# EAGLE design Lighthouse (EAGLE 9.6.2)
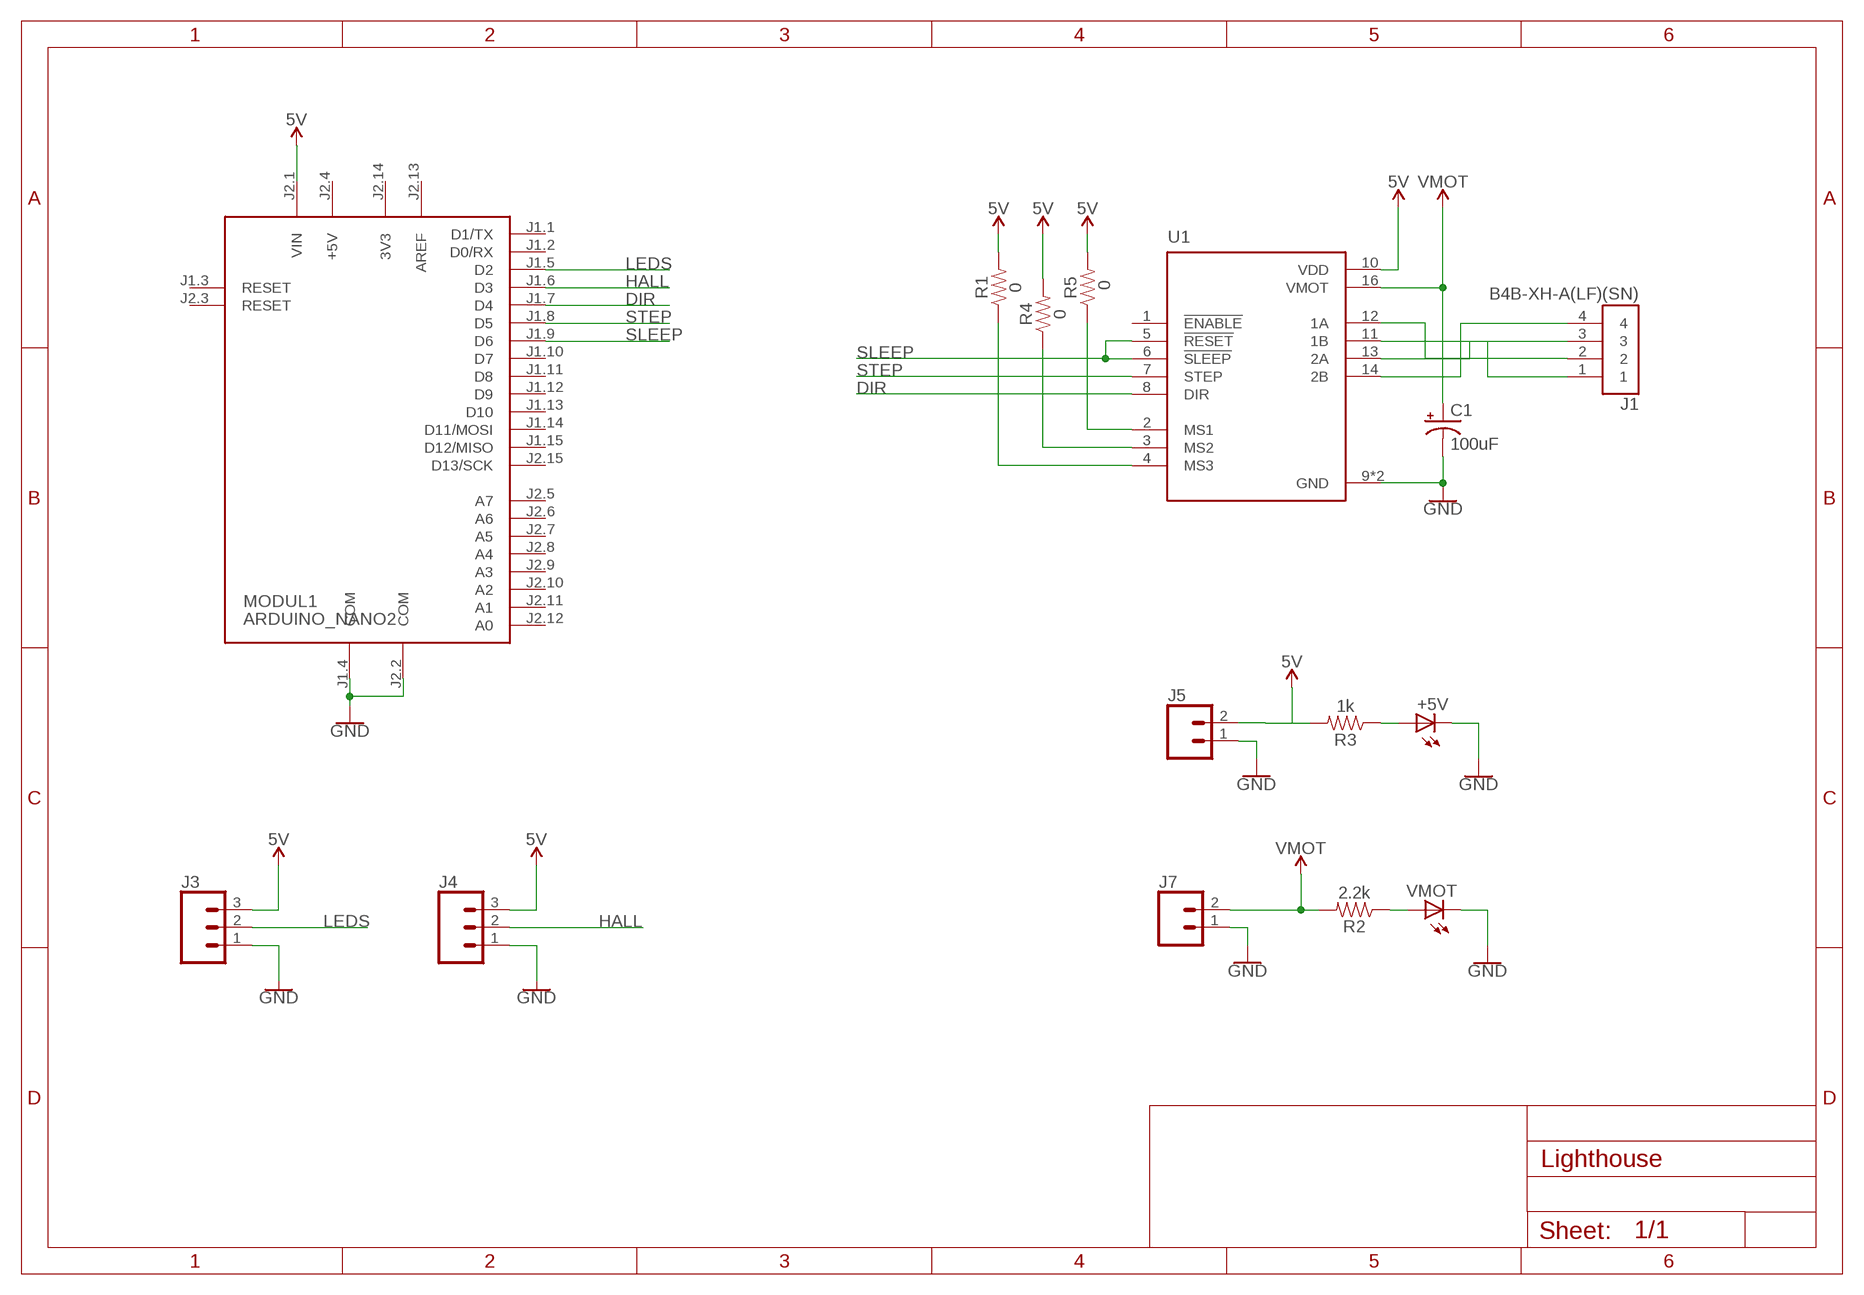
[diagram p0: schematic, sheet 1]

## Parts
+5V  LEDP-LCC-2  [P-LCC-2]
C1  100uF  100UF-POLAR-25V-20%(ELEC)  [PANASONIC_D]
J1  B4B-XH-A(LF)(SN)  [JST_B4B-XH-A(LF)(SN)]
J3  CONN_03SCREW  [SCREWTERMINAL-3.5MM-3]
J4  CONN_03SCREW  [SCREWTERMINAL-3.5MM-3]
J5  CONN_025MM  [SCREWTERMINAL-5MM-2]
J7  CONN_025MM  [SCREWTERMINAL-5MM-2]
MODUL1  ARDUINO_NANO2  [ARDUINO_NANO2]
R1  0  RESISTOR1206  [1206]
R2  2.2k  RESISTOR1206  [1206]
R3  1k  RESISTOR1206  [1206]
R4  0  RESISTOR1206  [1206]
R5  0  RESISTOR1206  [1206]
U1  A4988_STEPPER_MOTOR_DRIVER_CARRIER  [MODULE_A4988_STEPPER_MOTOR_DRIVER_CARRIER]
VMOT  LEDP-LCC-2  [P-LCC-2]

## Nets
5V: J3.3 J4.3 J5.2 MODUL1.J2.1(VIN) R1.2 R3.2 R4.2 R5.2 U1.10(VDD)
12V: C1.+ J7.2 R2.2 U1.16(VMOT) ; supply symbol labelled VMOT
DIR: MODUL1.J1.7(D4) U1.8(DIR)
GND: +5V.C C1.- J3.1 J4.1 J5.1 J7.1 MODUL1.J1.4(COM) MODUL1.J2.2(COM) U1.9(GND) U1.15(GND) VMOT.C
HALL: J4.2 MODUL1.J1.6(D3)
LEDS: J3.2 MODUL1.J1.5(D2)
N$1: +5V.A R3.1
N$3: R2.1 VMOT.A
N$7: J1.4 U1.14(2B)
N$8: J1.3 U1.13(2A)
N$9: J1.1 U1.11(1B)
N$10: J1.2 U1.12(1A)
N$11: R1.1 U1.4(MS3)
N$12: R4.1 U1.3(MS2)
N$13: R5.1 U1.2(MS1)
SLEEP: MODUL1.J1.9(D6) U1.5(!RESET) U1.6(!SLEEP)
STEP: MODUL1.J1.8(D5) U1.7(STEP)
Unconnected: MODUL1.J1.1(D1/TX) MODUL1.J1.2(D0/RX) MODUL1.J1.3(RESET) MODUL1.J1.10(D7) MODUL1.J1.11(D8) MODUL1.J1.12(D9) MODUL1.J1.13(D10) MODUL1.J1.14(D11/MOSI) MODUL1.J1.15(D12/MISO) MODUL1.J2.3(RESET) MODUL1.J2.5(A7) MODUL1.J2.6(A6) MODUL1.J2.7(A5) MODUL1.J2.8(A4) MODUL1.J2.9(A3) MODUL1.J2.10(A2) MODUL1.J2.11(A1) MODUL1.J2.12(A0) MODUL1.J2.15(D13/SCK) U1.1(!ENABLE)

## Power pins joined to a net without a drawn wire
3V3: MODUL1.J2.14(3V3)
+5V: MODUL1.J2.4(+5V)
AREF: MODUL1.J2.13(AREF)

## Library data of the parts
+5V VMOT = adafruit:LED: LED OSRAM: - CHIPLED LG R971, LG N971, LY N971, LG Q971, LY Q971, LO R971, LY R971 LH N974, LH R974 LS Q976, LO Q976, LY Q976 LO Q996 - Hyper CHIPLED LW Q18S LB Q993, LB Q99A, LB R99A - SideLED LS A670, LO A670, LY A670, LG A670, LP A670 LB A673, LV A673, LT A673, LW A673 LH A674 LY A675 LS A676, LA A676, LO A676, LY A676, LW A676 LS A679, LY A679, LG A679 - Hyper Micro SIDELED® LS Y876, LA Y876, LO Y876, LY Y876 LT Y87S - SmartLED LW L88C, LW L88S LB L89C, LB L89S, LG L890 LS L89K, LO L89K, LY L89K LS L896, LA L896, LO L896, LY L896 - TOPLED LS T670, LO T670, LY T670, LG T670, LP T670 LSG T670, LSP T670, LSY T670, LOP T670, LYG T670 LG T671, LOG T671, LSG T671 LB T673, LV T673, LT T673, LW T673 LH T674 LS T676, LA T676, LO T676, LY T676, LB T676, LH T676, LSB T676, LW T676 LB T67C, LV T67C, LT T67C, LS T67K, LO T67K, LY T67K, LW E67C LS E67B, LA E67B, LO E67B, LY E67B, LB E67C, LV E67C, LT E67C LW T67C LS T679, LY T679, LG T679 LS T770, LO T770, LY T770, LG T770, LP T770 LB T773, LV T773, LT T773, LW T773 LH T774 LS E675, LA E675, LY E675, LS T675 LS T776, LA T776, LO T776, LY T776, LB T776 LHGB T686 LT T68C, LB T68C - Hyper Mini TOPLED® LB M676 - Mini TOPLED Santana® LG M470 LS M47K, LO M47K, LY M47K Source: http://www.osram.convergy.de/
C1 = SparkFun-Capacitors:100UF-POLAR: 100µF polarized capacitors A capacitor is a passive two-terminal electrical component used to store electrical energy temporarily in an electric field.; PROD_ID: CAP-12547
J1 = B4B-XH-A_LF__SN_:B4B-XH-A(LF)(SN): XH Series 4 Position 2.5 mm Pitch Through Hole Crimp Top Entry Shrouded Header Check prices <https://pricing.snapeda.com/parts/B4B-XH-A%28LF%29%28SN%29/JST%20Sales/view-part?ref=eda>; AVAILABILITY: Warning; DESCRIPTION: Connector Header Through Hole 4 position 0.098 (2.50mm); MF: JST Sales; MP: B4B-XH-A(LF)(SN); PACKAGE: None; PRICE: None; PURCHASE-URL: https://pricing.snapeda.com/search/part/B4B-XH-A(LF)(SN)/?ref=eda
J3 J4 = SparkFun-Connectors:CONN_03: Multi connection point. Often used as Generic Header-pin footprint for 0.1 inch spaced/style header connections On any of the 0.1 inch spaced packages, you can populate with these: Break Away Headers - Straight <https://www.sparkfun.com/products/116> (PRT-00116) Break Away Male Headers - Right Angle <https://www.sparkfun.com/products/553> (PRT-00553) Female Headers <https://www.sparkfun.com/products/115> (PRT-00115) Break Away Headers - Machine Pin <https://www.sparkfun.com/products/117> (PRT-00117) Break Away Female Headers - Swiss Machine Pin <https://www.sparkfun.com/products/743> (PRT-00743) Stackable Header - 3 Pin (Female, 0.1") <https://www.sparkfun.com/products/13875> (PRT-13875) For SCREWTERMINALS and SPRING TERMINALS visit here: Screw Terimnals on SparkFun.com <https://www.sparkfun.com/search/results?term=Screw+Terminals> (5mm/3.5mm/2.54mm spacing) This device is also useful as a general connection point to wire up your design to another part of your project. Our various solder wires solder well into these plated through hole pads. Hook-Up Wire - Assortment (Stranded, 22 AWG) <https://www.sparkfun.com/products/11375> (PRT-11375) Hook-Up Wire - Assortment (Solid Core, 22 AWG) <https://www.sparkfun.com/products/11367> (PRT-11367) View the entire wire category on our website here <https://www.sparkfun.com/categories/141> Special notes: Molex polarized connector foot print use with SKU : PRT-08232 with associated crimp pins and housings.; PROD_ID: CONN-08288; SF_ID: PRT-08235
J5 J7 = SparkFun-Connectors:CONN_02: Multi connection point. Often used as Generic Header-pin footprint for 0.1 inch spaced/style header connections On any of the 0.1 inch spaced packages, you can populate with these: Break Away Headers - Straight <https://www.sparkfun.com/products/116> (PRT-00116) Break Away Male Headers - Right Angle <https://www.sparkfun.com/products/553> (PRT-00553) Female Headers <https://www.sparkfun.com/products/115> (PRT-00115) Break Away Headers - Machine Pin <https://www.sparkfun.com/products/117> (PRT-00117) Break Away Female Headers - Swiss Machine Pin <https://www.sparkfun.com/products/743> (PRT-00743) For SCREWTERMINALS and SPRING TERMINALS visit here: Screw Terimnals on SparkFun.com <https://www.sparkfun.com/search/results?term=Screw+Terminals> (5mm/3.5mm/2.54mm spacing) This device is also useful as a general connection point to wire up your design to another part of your project. Our various solder wires solder well into these plated through hole pads. Hook-Up Wire - Assortment (Stranded, 22 AWG) <https://www.sparkfun.com/products/11375> (PRT-11375) Hook-Up Wire - Assortment (Solid Core, 22 AWG) <https://www.sparkfun.com/products/11367> (PRT-11367) View the entire wire category on our website here <https://www.sparkfun.com/categories/141> Special notes: Molex polarized connector foot print use with: PRT-08233 with associated crimp pins and housings. 2.54_SCREWTERM for use with PRT-10571. 3.5mm Screw Terminal footprints for PRT-08084 5mm Screw Terminal footprints for use with PRT-08432; SF_SKU: PRT-08432
MODUL1 = arduino:ARDUINO_NANO2: Arduino Nano2 Auto generated by modulcreator.ulp \;; ANZAHL: 2; MODUL: TRUE; STECKX0: -76200; STECKX1: 76200; STECKY0: 177800; STECKY1: 177800
R1-R5 = SparkFun-Resistors:RESISTOR: Generic Resistor Package
U1 = A4988_STEPPER_MOTOR_DRIVER_CARRIER:A4988_STEPPER_MOTOR_DRIVER_CARRIER: Stepper motor controler; IC: A4988; 1A; Uin mot: 8÷35V; AVAILABILITY: Unavailable; DESCRIPTION: Stepper Motor Driver; MF: Pololu; MP: A4988 STEPPER MOTOR DRIVER CARRIER; PACKAGE: None; PRICE: None

## Board
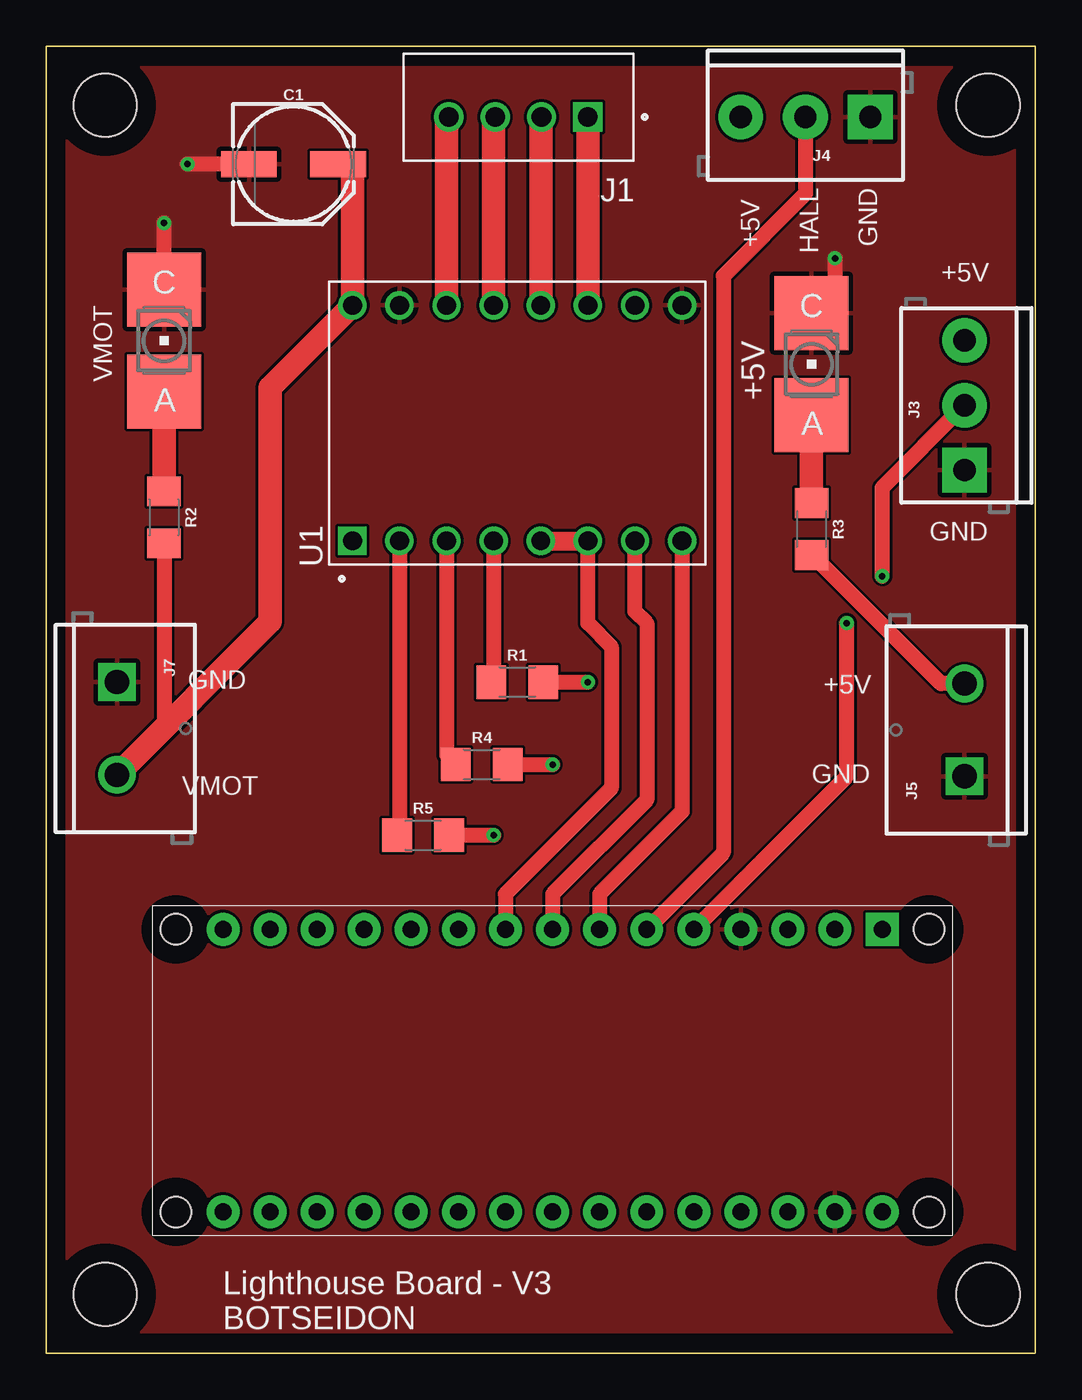
[diagram p1: board, top side]
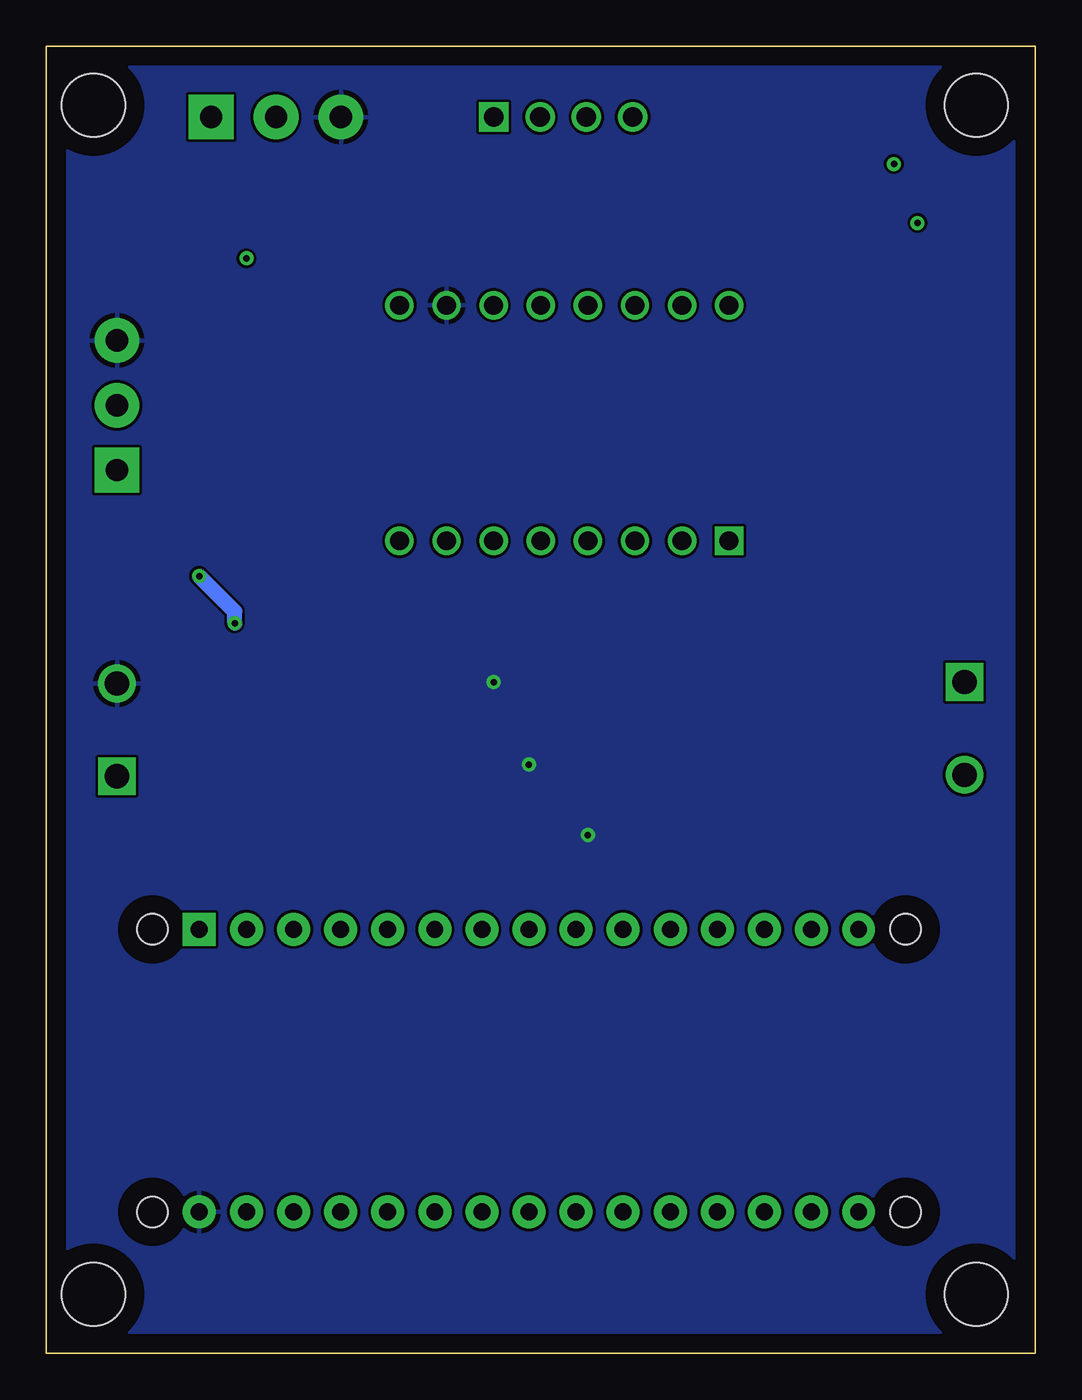
[diagram p2: board, bottom side, seen from below]

Size 53.34 x 70.48 mm. Coordinates in mm from the lower left corner, seen from the top.
Outline: 0,0 0,70.48 53.34,70.48 53.34,0 0,0
Copper layers (1*16): Top 0.035mm / dielectric 1.5mm / Bottom 0.035mm
Design rules "default": minimum track width 6mil, minimum drill 0.35mm, track to track 6mil, track to pad 6mil, pad to pad 6mil, via to via 6mil, smd to smd 6mil, copper to edge 40mil, drill to drill 6mil, minimum pad ring 10mil, minimum via ring 8mil, stop-mask expansion 4mil, vias tented up to drill 0mil, thermal gap 10mil
Holes 3.43 mm at 3.17,3.17 50.8,3.17 3.17,67.31 50.8,67.31

### Footprints (pad centres in the part's own frame; a part is rotated, then mirrored left to right if it is on the bottom)
P-LCC-2 = smd 4 x 4: A 0,2.75; C 0,-2.75
PANASONIC_D = smd 3 x 1.4: + 2.4,0; - -2.4,0
JST_B4B-XH-A(LF)(SN) = drill 1.06 square: 1 0,0 | drill 1.06: 2 2.5,0; 3 5,0; 4 7.5,0
SCREWTERMINAL-3.5MM-3 = drill 1.2 pad 2.413 square: 1 0,0 | drill 1.2 pad 2.413: 2 3.5,0; 3 7,0
SCREWTERMINAL-5MM-2 = drill 1.3 pad 2.032 square: 1 0,0 | drill 1.3 pad 2.032: 2 5,0
ARDUINO_NANO2 = drill 0.914 pad 1.778 square: J1.1 -7.62,17.78 | drill 0.914 pad 1.778: J1.2 -7.62,15.24; J1.3 -7.62,12.7; J1.4 -7.62,10.16; J1.5 -7.62,7.62; J1.6 -7.62,5.08; J1.7 -7.62,2.54; J1.8 -7.62,0; J1.9 -7.62,-2.54; J1.10 -7.62,-5.08; J1.11 -7.62,-7.62; J1.12 -7.62,-10.16; J1.13 -7.62,-12.7; J1.14 -7.62,-15.24; J1.15 -7.62,-17.78; J2.1 7.62,17.78; J2.2 7.62,15.24; J2.3 7.62,12.7; J2.4 7.62,10.16; J2.5 7.62,7.62; J2.6 7.62,5.08; J2.7 7.62,2.54; J2.8 7.62,0; J2.9 7.62,-2.54; J2.10 7.62,-5.08; J2.11 7.62,-7.62; J2.12 7.62,-10.16; J2.13 7.62,-12.7; J2.14 7.62,-15.24; J2.15 7.62,-17.78 | hole 1.651: -7.62,-20.32; 7.62,-20.32; 7.62,20.32; -7.62,20.32
1206 = smd 1.6 x 1.8: 1 -1.4,0; 2 1.4,0
MODULE_A4988_STEPPER_MOTOR_DRIVER_CARRIER = drill 1.02 square: 1 -6.35,8.89 | drill 1.02: 2 -6.35,6.35; 3 -6.35,3.81; 4 -6.35,1.27; 5 -6.35,-1.27; 6 -6.35,-3.81; 7 -6.35,-6.35; 8 -6.35,-8.89; 9 6.35,-8.89; 10 6.35,-6.35; 11 6.35,-3.81; 12 6.35,-1.27; 13 6.35,1.27; 14 6.35,3.81; 15 6.35,6.35; 16 6.35,8.89

### Placement (x,y rotation side)
+5V  41.27,53.34 180 top
C1  13.34,64.14 0 top
J1  29.21,66.67 180 top
J3  49.53,47.62 90 top
J4  44.45,66.67 180 top
J5  49.53,31.11 90 top
J7  3.81,36.2 270 top
MODUL1  27.3,15.24 270 top
R1  25.4,36.2 0 top
R2  6.35,45.09 270 top
R3  41.27,44.45 270 top
R4  23.5,31.75 0 top
R5  20.32,27.94 0 top
U1  25.4,50.16 90 top
VMOT  6.35,54.61 180 top

### Tracks (layer width: path | path; a pad name or v marks a point on that pad's centre or on a via)
5V  (via drill 0.35)
  Top 0.813: R5.2 v24.13,27.94 | R4.2 v27.3,31.75 | R1.2 v29.21,36.2 | J5.2 48.26,36.12 41.33,43.05 R3.2
  pour Bottom: 0,70.48 53.34,70.48 53.34,0 0,0
12V
  Top 0.813: R2.2 6.35,33.73 J7.2
  Top 1.27: C1.+ 16.51,64.14 U1.16 12.06,52.07 12.06,39.45 J7.2
DIR
  Top 0.813: MODUL1.J1.7 29.84,24.77 34.29,29.21 U1.8
GND  (via drill 0.35)
  Top 0.813: C1.- v7.62,64.14 | +5V.C 41.27,56.52 41.91,57.15 42.55,57.78 v42.55,59.05 | VMOT.C v6.35,60.96
  pour Top: 0,70.48 53.34,70.48 53.34,0 0,0
HALL
  Top 0.813: MODUL1.J1.6 36.51,26.99 36.51,58.1 40.95,62.54 J4.2
LEDS  (via drill 0.35)
  Top 0.813: v43.18,39.37 43.18,31.11 MODUL1.J1.5 | v45.09,41.91 45.09,46.68 J3.2
  Bottom 0.813: v45.09,41.91 43.18,40.01 v43.18,39.37
N$1
  Top 1.27: +5V.A R3.1
N$3
  Top 1.27: R2.1 VMOT.A
N$7
  Top 1.27: U1.14 21.59,66.56 J1.4
N$8
  Top 1.27: U1.13 24.13,66.59 J1.3
N$9
  Top 1.27: U1.11 J1.1
N$10
  Top 1.27: U1.12 26.67,66.64 J1.2
N$11
  Top 0.813: U1.4 24.13,36.33 R1.1
N$12
  Top 0.813: U1.3 21.59,32.26 R4.1
N$13
  Top 0.813: U1.2 19.05,28.07 R5.1
SLEEP
  Top 0.813: U1.6 29.21,39.37 30.48,38.1 30.48,30.48 24.77,24.77 MODUL1.J1.9
  Top 1.016: U1.5 U1.6
STEP
  Top 0.813: U1.7 31.75,40.01 32.38,39.37 32.38,29.84 27.3,24.77 MODUL1.J1.8

### Text on the board
tNames: HALL | GND | +5V | +5V | GND | GND | +5V | GND | VMOT | Lighthouse Board - V3 / BOTSEIDON